# EAGLE design 04_ADD (EAGLE 7.5.0)
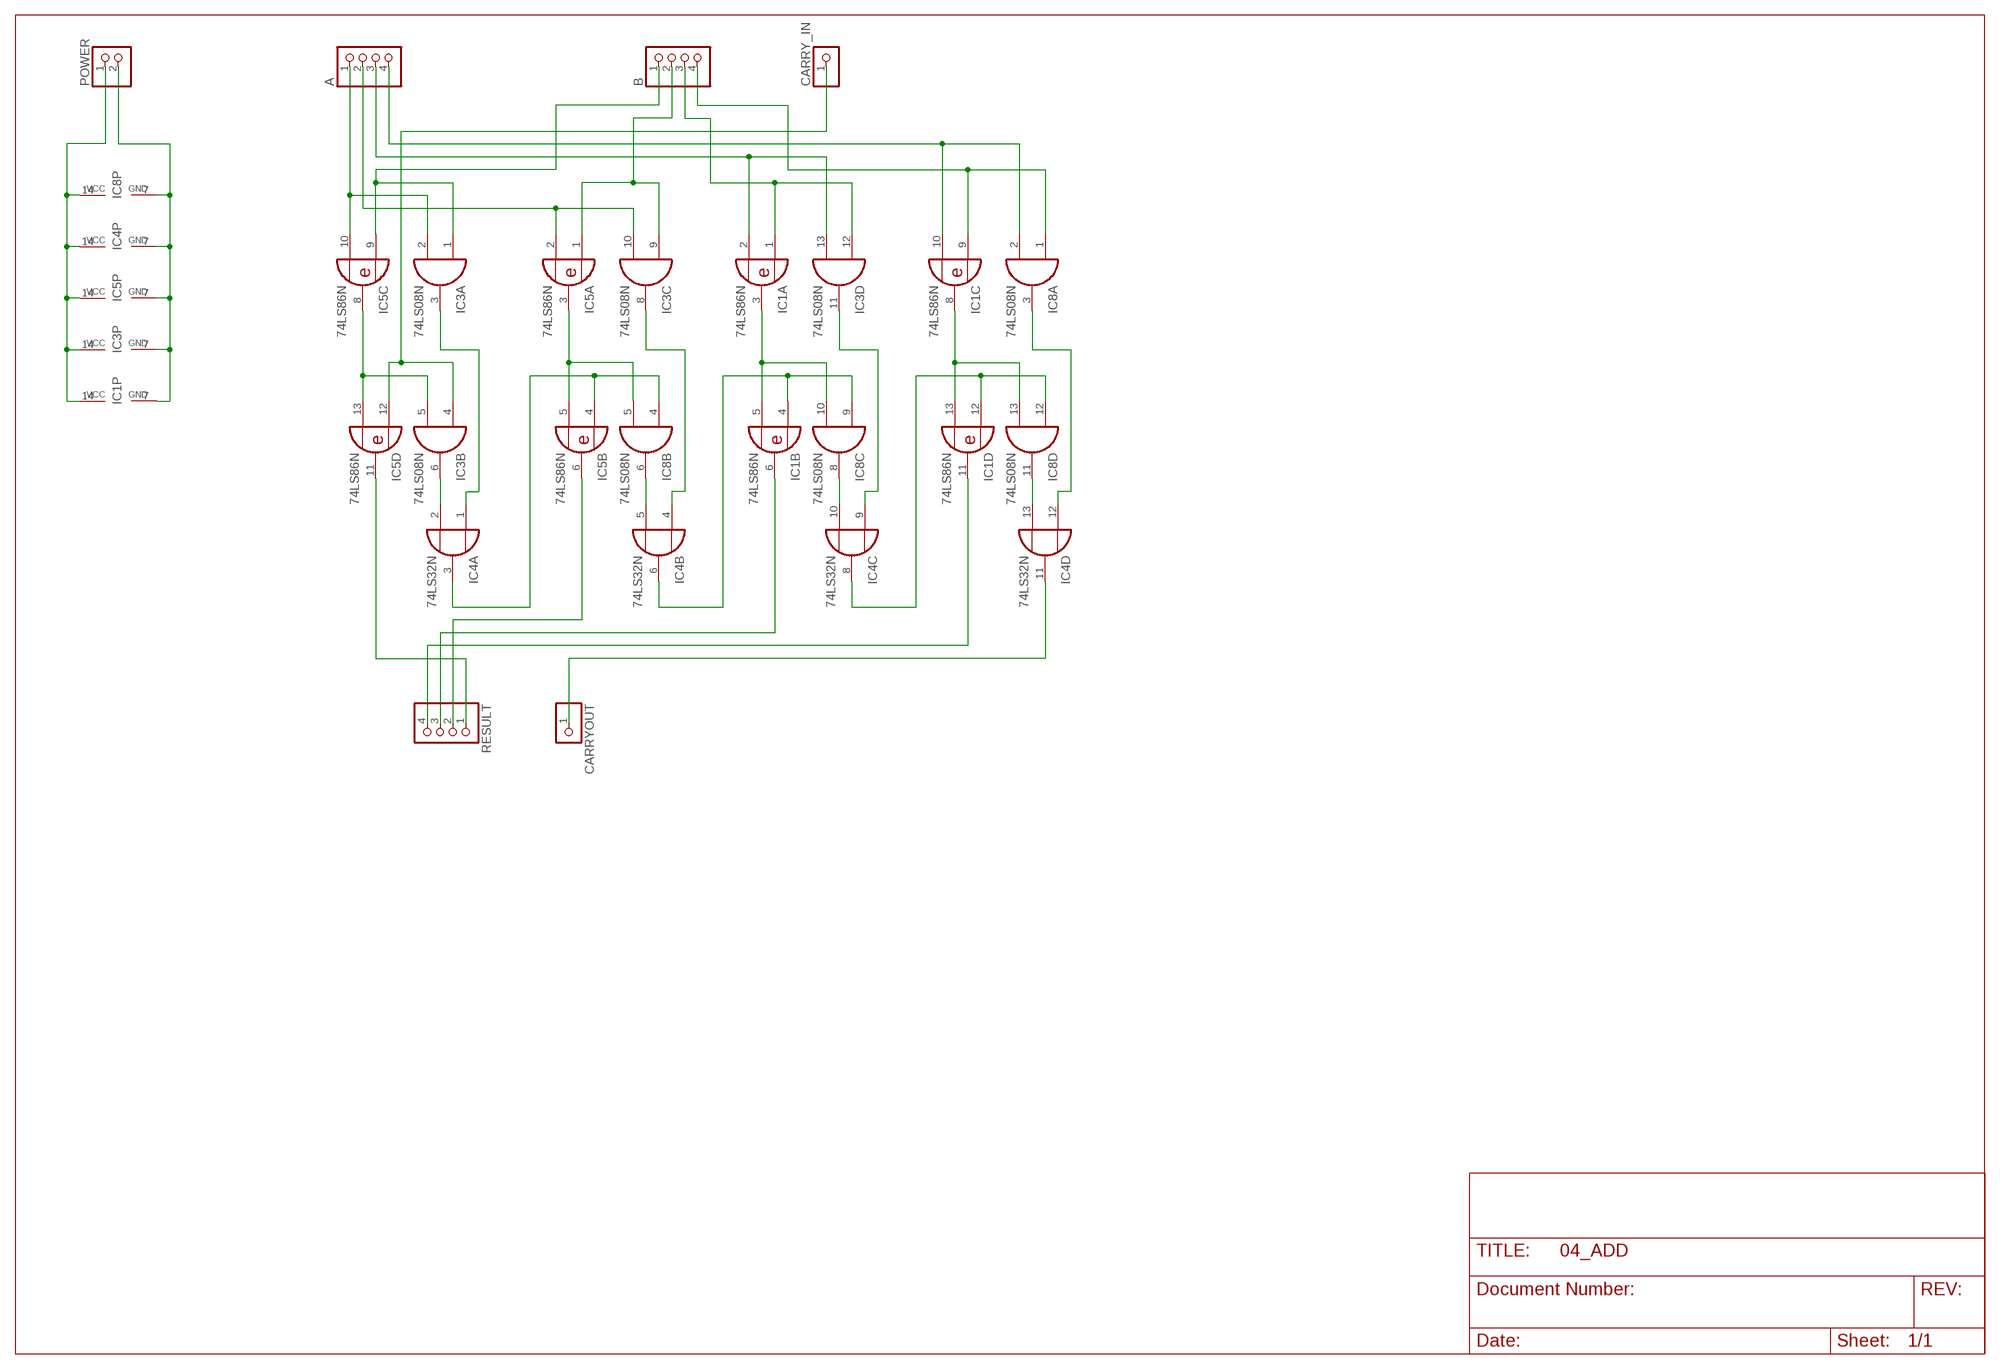
[diagram p0: schematic, sheet 1]

## Parts
A  PINHD-1X4  [1X04]
B  PINHD-1X4  [1X04]
CARRY_IN  PINHD-1X1  [1X01]
CARRYOUT  PINHD-1X1  [1X01]
IC1  74LS86N  [DIL14]
IC3  74LS08N  [DIL14]
IC4  74LS32N  [DIL14]
IC5  74LS86N  [DIL14]
IC8  74LS08N  [DIL14]
POWER  PINHD-1X2  [1X02]
RESULT  PINHD-1X4  [1X04]

## Nets
CARRY_OUT: CARRYOUT.1 IC4.11(D:O)
GND: IC1.7(P:GND) IC3.7(P:GND) IC4.7(P:GND) IC5.7(P:GND) IC8.7(P:GND) POWER.2
N$1: B.1 IC3.1(A:I0) IC5.9(C:I0)
N$3: B.3 IC1.1(A:I0) IC3.12(D:I0)
N$5: CARRY_IN.1 IC3.4(B:I0) IC5.12(D:I0)
N$6: A.1 IC3.2(A:I1) IC5.10(C:I1)
N$8: IC3.5(B:I1) IC5.8(C:O) IC5.13(D:I1)
N$9: IC5.11(D:O) RESULT.1
N$10: IC3.3(A:O) IC4.1(A:I0)
N$11: IC3.6(B:O) IC4.2(A:I1)
N$12: A.2 IC3.10(C:I1) IC5.2(A:I1)
N$13: A.3 IC1.2(A:I1) IC3.13(D:I1)
N$14: A.4 IC1.10(C:I1) IC8.2(A:I1)
N$15: B.2 IC3.9(C:I0) IC5.1(A:I0)
N$17: B.4 IC1.9(C:I0) IC8.1(A:I0)
N$18: IC5.3(A:O) IC5.5(B:I1) IC8.5(B:I1)
N$19: IC1.6(B:O) RESULT.3
N$20: IC1.3(A:O) IC1.5(B:I1) IC8.10(C:I1)
N$21: IC1.8(C:O) IC1.13(D:I1) IC8.13(D:I1)
N$22: IC4.3(A:O) IC5.4(B:I0) IC8.4(B:I0)
N$23: IC5.6(B:O) RESULT.2
N$24: IC1.11(D:O) RESULT.4
N$25: IC4.5(B:I1) IC8.6(B:O)
N$26: IC4.10(C:I1) IC8.8(C:O)
N$27: IC4.13(D:I1) IC8.11(D:O)
N$28: IC3.8(C:O) IC4.4(B:I0)
N$29: IC3.11(D:O) IC4.9(C:I0)
N$30: IC4.12(D:I0) IC8.3(A:O)
N$31: IC1.4(B:I0) IC4.6(B:O) IC8.9(C:I0)
N$32: IC1.12(D:I0) IC4.8(C:O) IC8.12(D:I0)
VCC: IC1.14(P:VCC) IC3.14(P:VCC) IC4.14(P:VCC) IC5.14(P:VCC) IC8.14(P:VCC) POWER.1

## Library data of the parts
A B RESULT = pinhead:PINHD-1X4: PIN HEADER
CARRY_IN CARRYOUT = pinhead:PINHD-1X1: PIN HEADER
IC1 IC5 = 74xx-eu:74*86: Quad 2-input EXCLUSIVE-OR (XOR) gate
IC3 IC8 = 74xx-eu:74*08: Quad 2-input AND gate
IC4 = 74xx-eu:74*32: Quad 2-input OR gate
POWER = pinhead:PINHD-1X2: PIN HEADER

## Board
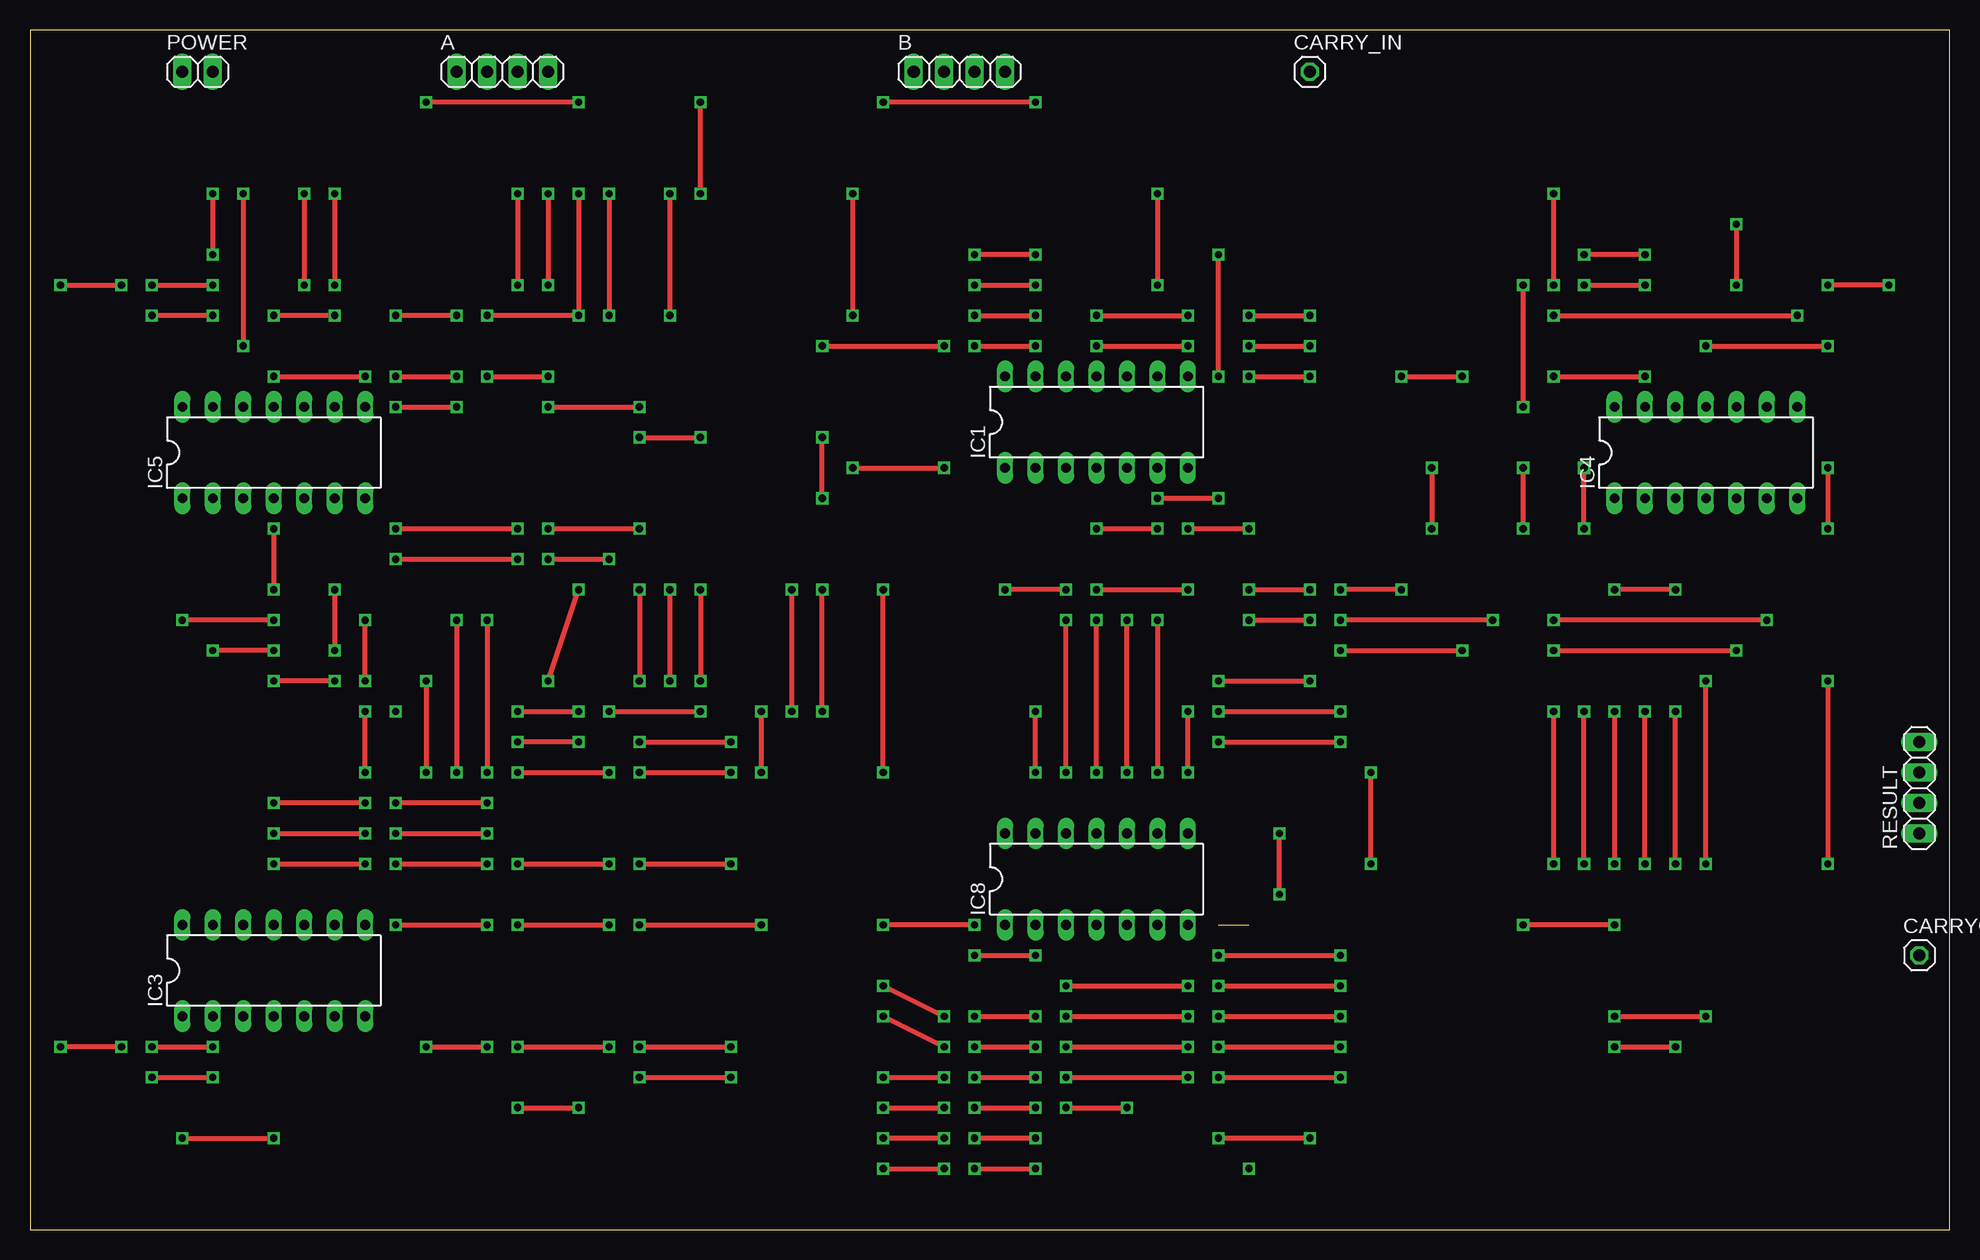
[diagram p1: board, top side]
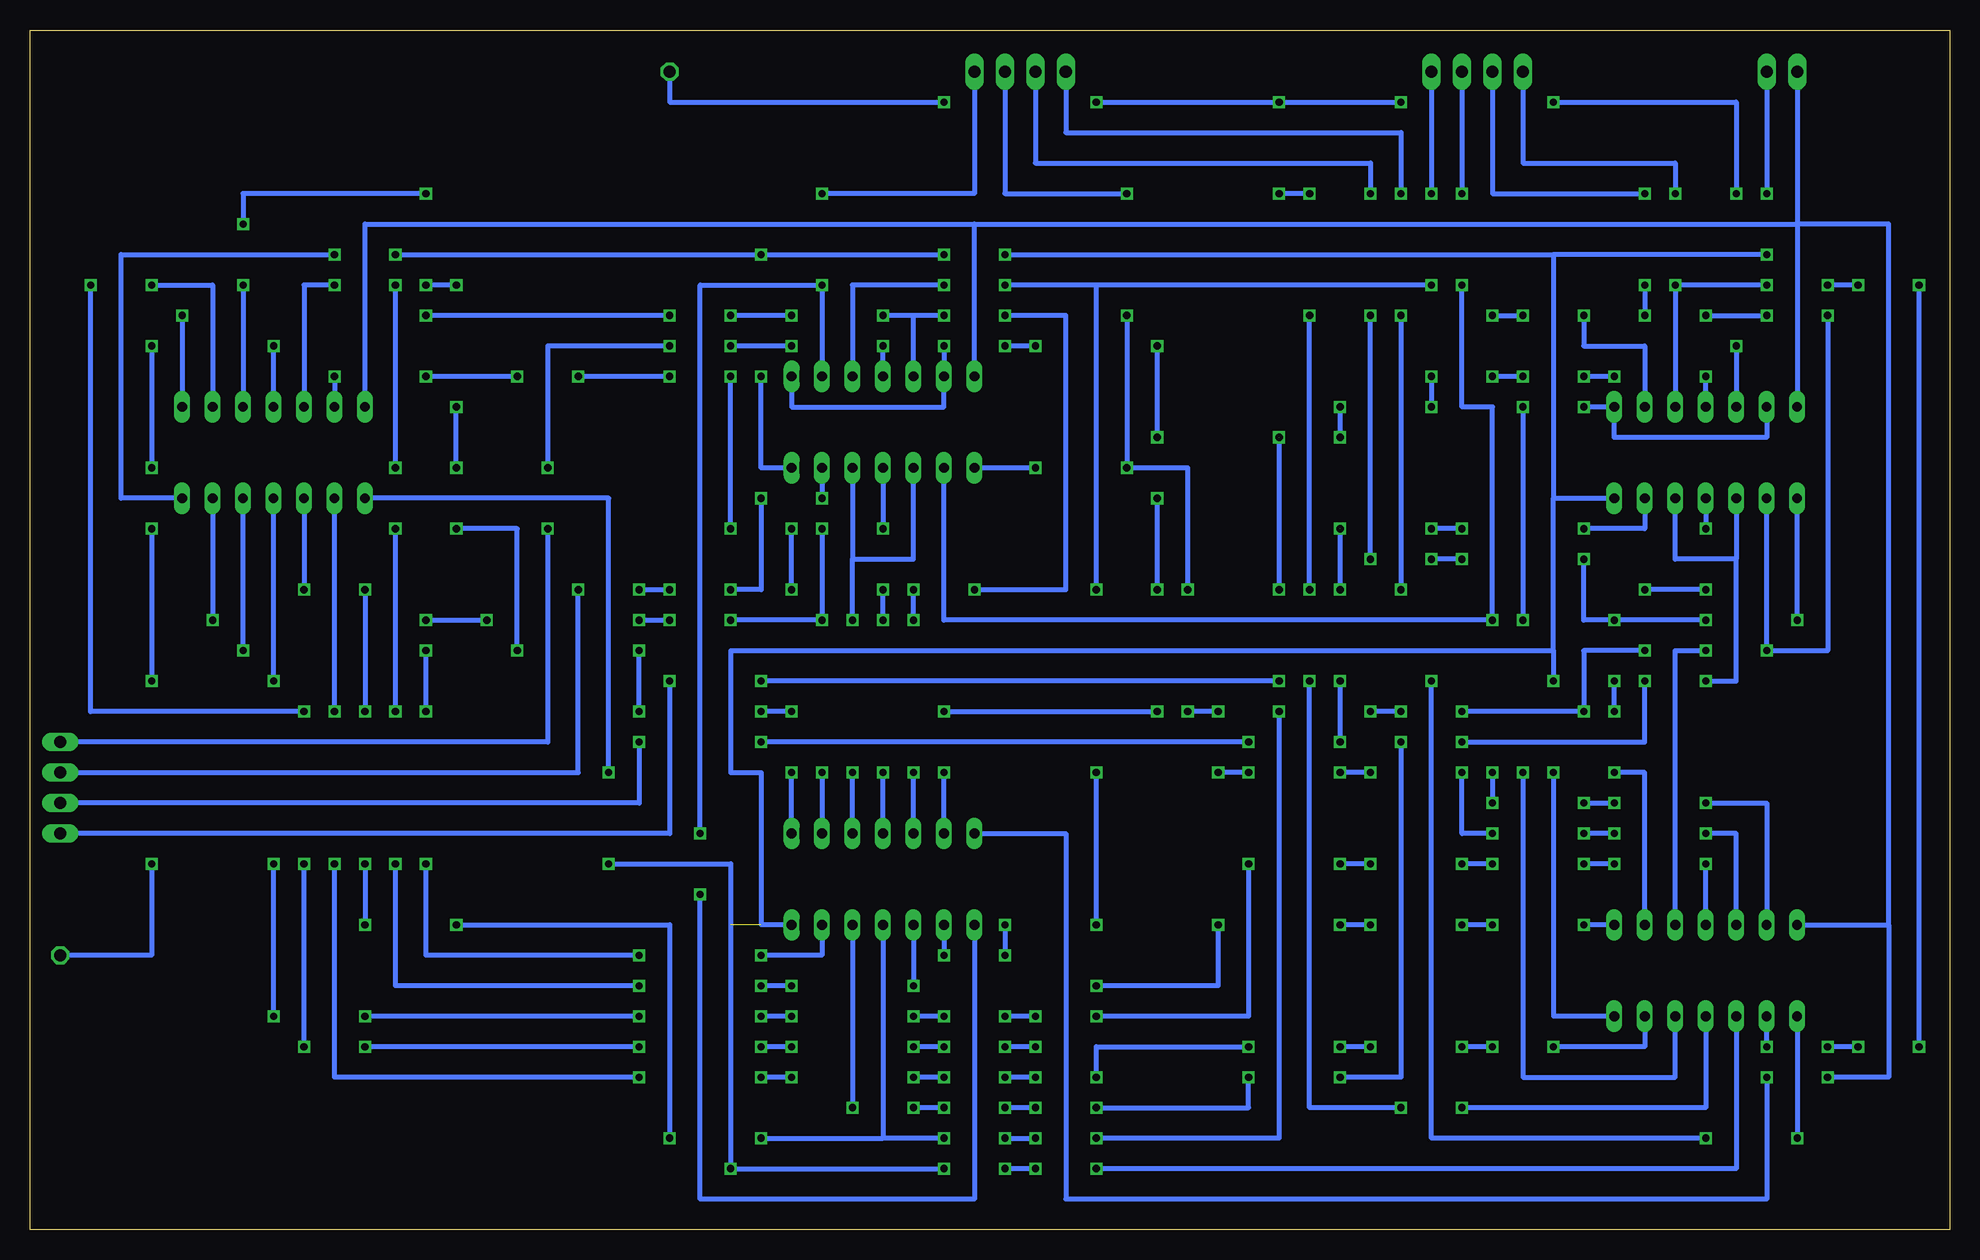
[diagram p2: board, bottom side, seen from below]

Size 160 x 100 mm. Coordinates in mm from the lower left corner, seen from the top.
Outline: 0,0 160,0 160,100 0,100 0,0
Copper layers (1*16): Top 0.035mm / dielectric 1.5mm / Bottom 0.035mm
Design rules "default": minimum track width 10mil, minimum drill 24mil, track to track 8mil, track to pad 8mil, pad to pad 8mil, via to via 8mil, smd to smd 8mil, copper to edge 40mil, drill to drill 8mil, minimum pad ring 10mil, minimum via ring 8mil, stop-mask expansion 4mil, vias tented up to drill 0mil, thermal gap 10mil

### Footprints (pad centres in the part's own frame; a part is rotated, then mirrored left to right if it is on the bottom)
1X04 = drill 1.016 long: 1 -3.81,0; 2 -1.27,0; 3 1.27,0; 4 3.81,0
1X01 = drill 1.016 octagon: 1 0,0
DIL14 = drill 0.813 long: 1 -7.62,-3.81; 2 -5.08,-3.81; 3 -2.54,-3.81; 4 0,-3.81; 5 2.54,-3.81; 6 5.08,-3.81; 7 7.62,-3.81; 8 7.62,3.81; 9 5.08,3.81; 10 2.54,3.81; 11 0,3.81; 12 -2.54,3.81; 13 -5.08,3.81; 14 -7.62,3.81
1X02 = drill 1.016 long: 1 -1.27,0; 2 1.27,0

### Placement (x,y rotation side)
A  39.37,96.52 0 top
B  77.47,96.52 0 top
CARRY_IN  106.68,96.52 0 top
CARRYOUT  157.48,22.86 0 top
IC1  88.9,67.31 0 top
IC3  20.32,21.59 0 top
IC4  139.7,64.77 0 top
IC5  20.32,64.77 0 top
IC8  88.9,29.21 0 top
POWER  13.97,96.52 0 top
RESULT  157.48,36.83 90 top

### Tracks (layer width: path | path; a pad name or v marks a point on that pad's centre or on a via)
CARRY_OUT  (via drill 0.6)
  Top 0.406: v139.7,73.66 v149.86,73.66 | v149.86,63.5 v149.86,58.42 | v149.86,45.72 v149.86,30.48
  Bottom 0.406: IC4.11 v139.7,73.66 | v149.86,73.66 v149.86,63.5 | v149.86,58.42 v149.86,45.72 | v149.86,30.48 149.86,22.86 CARRYOUT.1
GND  (via drill 0.6)  (1 unrouted)
  Top 0.406: v15.24,86.36 v15.24,81.28 | v134.62,81.28 v129.54,81.28 | v83.82,81.28 v78.74,81.28 | v33.02,45.72 v33.02,38.1 | v99.06,71.12 v99.06,81.28
  Bottom 0.406: POWER.2 v15.24,86.36 | v15.24,81.28 33.02,81.28 | 33.02,81.28 33.02,60.96 | 33.02,60.96 IC5.7 | 33.02,48.26 101.6,48.26 101.6,38.1 99.06,38.1 99.06,25.4 IC8.7 | 33.02,48.26 33.02,60.96 | IC3.7 33.02,17.78 v33.02,38.1 | IC4.7 152.4,60.96 152.4,81.28 v134.62,81.28 | v129.54,81.28 v99.06,81.28 v83.82,81.28 | v78.74,81.28 33.02,81.28 | 33.02,48.26 v33.02,45.72 | IC1.7 99.06,63.5 v99.06,71.12
N$1  (via drill 0.6)
  Top 0.406: v45.72,86.36 v45.72,76.2 v38.1,76.2 | v35.56,76.2 v30.48,76.2 | v12.7,7.62 v20.32,7.62 | v43.18,45.72 v45.72,53.34
  Bottom 0.406: B.1 73.66,91.44 45.72,91.44 v45.72,86.36 | v38.1,76.2 v35.56,76.2 | v30.48,76.2 30.48,73.66 25.4,73.66 IC5.9 | IC3.1 v12.7,7.62 | v20.32,7.62 43.18,7.62 v43.18,45.72 | v45.72,76.2 v45.72,53.34
N$3  (via drill 0.6)
  Top 0.406: v68.58,86.36 v68.58,76.2 | v68.58,63.5 v76.2,63.5 | v20.32,33.02 v27.94,33.02 | v30.48,33.02 v38.1,33.02 | v40.64,38.1 v48.26,38.1 | v50.8,38.1 v58.42,38.1 | v60.96,38.1 v60.96,43.18 | v63.5,43.18 v63.5,53.34
  Bottom 0.406: B.3 78.74,86.36 v68.58,86.36 | v68.58,76.2 v68.58,63.5 63.5,63.5 v63.5,53.34 | v76.2,63.5 IC1.1 | IC3.12 17.78,33.02 v20.32,33.02 | v27.94,33.02 v30.48,33.02 | v38.1,33.02 40.64,33.02 v40.64,38.1 | v48.26,38.1 v50.8,38.1 | v58.42,38.1 v60.96,38.1 | v60.96,43.18 v63.5,43.18
N$5  (via drill 0.6)
  Top 0.406: v83.82,93.98 v71.12,93.98 | v45.72,93.98 v33.02,93.98 | v17.78,86.36 v17.78,73.66 | v53.34,45.72 v53.34,53.34 | v40.64,10.16 v45.72,10.16 | v53.34,76.2 v53.34,86.36 | v55.88,86.36 v55.88,93.98
  Bottom 0.406: CARRY_IN.1 106.68,93.98 v83.82,93.98 | v71.12,93.98 v55.88,93.98 v45.72,93.98 | v33.02,93.98 17.78,93.98 v17.78,86.36 | v17.78,73.66 IC5.12 | IC3.4 20.32,10.16 v40.64,10.16 | v45.72,10.16 53.34,10.16 v53.34,45.72 | v53.34,53.34 v53.34,76.2 | v53.34,86.36 v55.88,86.36
N$6  (via drill 0.6)
  Top 0.406: v22.86,86.36 v22.86,78.74 | v7.62,15.24 v2.54,15.24 | v2.54,78.74 v7.62,78.74 | v10.16,78.74 v15.24,78.74 | v10.16,15.24 v15.24,15.24
  Bottom 0.406: A.1 35.56,88.9 22.86,88.9 v22.86,86.36 | IC5.10 v22.86,78.74 v15.24,78.74 | v2.54,15.24 v2.54,78.74 | v7.62,78.74 v10.16,78.74 | v7.62,15.24 v10.16,15.24 | v15.24,15.24 IC3.2
N$8  (via drill 0.6)
  Top 0.406: v30.48,68.58 v35.56,68.58 | v35.56,50.8 v35.56,38.1
  Bottom 0.406: IC5.13 15.24,66.04 27.94,66.04 IC5.8 v30.48,68.58 | v35.56,68.58 v35.56,50.8 | IC3.5 22.86,12.7 35.56,12.7 v35.56,38.1
N$9  (via drill 0.6)  (1 unrouted)
  Top 0.406: v20.32,71.12 v27.94,71.12 | v30.48,71.12 v35.56,71.12 | v55.88,53.34 v55.88,45.72 | v99.06,45.72 v106.68,45.72 | v38.1,71.12 v43.18,71.12 | v43.18,68.58 v50.8,68.58 | v50.8,66.04 v55.88,66.04
  Bottom 0.406: IC5.11 v20.32,71.12 | v27.94,71.12 v30.48,71.12 | v35.56,71.12 v38.1,71.12 | v55.88,66.04 v55.88,53.34 | v55.88,45.72 v99.06,45.72 | v106.68,45.72 106.68,33.02 RESULT.1 | v43.18,71.12 v43.18,68.58 | v50.8,68.58 v50.8,66.04
N$10  (via drill 0.6)
  Top 0.406: v71.12,5.08 v76.2,5.08 | v111.76,30.48 v111.76,38.1 | v78.74,5.08 v83.82,5.08
  Bottom 0.406: v111.76,38.1 111.76,60.96 IC4.1 | v76.2,5.08 v78.74,5.08 | IC3.3 17.78,5.08 v71.12,5.08 | v83.82,5.08 v101.6,5.08 101.6,30.48 v111.76,30.48
N$11  (via drill 0.6)
  Top 0.406: v33.02,15.24 v38.1,15.24 | v40.64,15.24 v48.26,15.24 | v50.8,15.24 v58.42,15.24 | v71.12,12.7 v76.2,12.7 | v78.74,12.7 v83.82,12.7 | v86.36,12.7 v96.52,12.7 | v99.06,12.7 v109.22,12.7 | v134.62,30.48 v134.62,43.18
  Bottom 0.406: IC3.6 25.4,15.24 v33.02,15.24 | v38.1,15.24 v40.64,15.24 | v48.26,15.24 v50.8,15.24 | v76.2,12.7 v78.74,12.7 | v83.82,12.7 v86.36,12.7 | v96.52,12.7 v99.06,12.7 | v109.22,12.7 134.62,12.7 v134.62,30.48 | v134.62,43.18 IC4.2 | v71.12,12.7 71.12,15.24 v58.42,15.24
N$12  (via drill 0.6)
  Top 0.406: v25.4,86.36 v25.4,78.74 | v25.4,76.2 v20.32,76.2 | v15.24,76.2 v10.16,76.2 | v20.32,48.26 v15.24,48.26
  Bottom 0.406: A.2 38.1,86.36 v25.4,86.36 | v25.4,78.74 v25.4,76.2 | v20.32,76.2 v15.24,76.2 | v10.16,76.2 10.16,48.26 v15.24,48.26 IC5.2 | IC3.10 22.86,48.26 v20.32,48.26
N$13  (via drill 0.6)
  Top 0.406: v40.64,86.36 v40.64,78.74 | v38.1,50.8 v38.1,38.1 | v38.1,35.56 v30.48,35.56 | v27.94,35.56 v20.32,35.56
  Bottom 0.406: A.3 v40.64,86.36 | IC1.2 83.82,50.8 v38.1,50.8 38.1,68.58 40.64,68.58 v40.64,78.74 | v38.1,38.1 v38.1,35.56 | v30.48,35.56 v27.94,35.56 | v20.32,35.56 15.24,35.56 IC3.13
N$14  (via drill 0.6)
  Top 0.406: v43.18,86.36 v43.18,78.74 | v78.74,78.74 v83.82,78.74 | v71.12,38.1 v71.12,53.34 | v78.74,25.4 v71.12,25.4 | v78.74,22.86 v83.82,22.86
  Bottom 0.406: A.4 v43.18,86.36 | v43.18,78.74 71.12,78.74 | 71.12,78.74 v78.74,78.74 | v83.82,78.74 91.44,78.74 IC1.10 | IC8.2 v83.82,22.86 | v71.12,25.4 v71.12,38.1 | v71.12,53.34 71.12,78.74 | v78.74,25.4 v78.74,22.86
N$15  (via drill 0.6)
  Top 0.406: v48.26,86.36 v48.26,76.2 | v20.32,50.8 v12.7,50.8 | v27.94,38.1 v27.94,43.18 | v27.94,45.72 v27.94,50.8 | v30.48,55.88 v40.64,55.88 | v43.18,55.88 v48.26,55.88
  Bottom 0.406: B.2 76.2,88.9 48.26,88.9 v48.26,86.36 | v12.7,50.8 IC5.1 | v20.32,50.8 v27.94,50.8 30.48,50.8 v30.48,55.88 | IC3.9 25.4,38.1 v27.94,38.1 | v27.94,43.18 v27.94,45.72 | v48.26,55.88 v48.26,76.2 | v40.64,55.88 v43.18,55.88
N$17  (via drill 0.6)
  Top 0.406: v93.98,86.36 v93.98,78.74 | v104.14,27.94 v104.14,33.02
  Bottom 0.406: B.4 81.28,86.36 v93.98,86.36 | IC1.9 v93.98,78.74 104.14,78.74 v104.14,33.02 | IC8.1 81.28,2.54 104.14,2.54 v104.14,27.94
  other vias: 81.28,25.4
N$18  (via drill 0.6)
  Top 0.406: v45.72,40.64 v40.64,40.64 | v25.4,45.72 v20.32,45.72 | v50.8,12.7 v58.42,12.7 | v71.12,10.16 v76.2,10.16 | v78.74,10.16 v83.82,10.16 | v86.36,10.16 v91.44,10.16
  Bottom 0.406: IC5.3 17.78,55.88 | 17.78,55.88 22.86,55.88 IC5.5 | IC8.5 v91.44,10.16 | v20.32,45.72 17.78,45.72 17.78,55.88 | v40.64,40.64 25.4,40.64 v25.4,45.72 | v45.72,40.64 45.72,12.7 v50.8,12.7 | v76.2,10.16 v78.74,10.16 | v83.82,10.16 v86.36,10.16 | v71.12,10.16 58.42,10.16 v58.42,12.7
N$19  (via drill 0.6)
  Top 0.406: v114.3,53.34 v109.22,53.34 | v93.98,60.96 v99.06,60.96 | v101.6,53.34 v106.68,53.34
  Bottom 0.406: RESULT.3 114.3,38.1 v114.3,53.34 | v109.22,53.34 v106.68,53.34 | IC1.6 v93.98,60.96 | v99.06,60.96 99.06,53.34 v101.6,53.34
  other vias: 93.98,63.5
N$20  (via drill 0.6)
  Top 0.406: v91.44,38.1 v91.44,50.8
  Bottom 0.406: IC1.5 91.44,55.88 | 91.44,55.88 86.36,55.88 IC1.3 | IC8.10 v91.44,38.1 | v91.44,50.8 91.44,55.88
N$21  (via drill 0.6)
  Top 0.406: v83.82,38.1 v83.82,43.18 | v66.04,43.18 v66.04,53.34 | v66.04,60.96 v66.04,66.04 | v66.04,73.66 v76.2,73.66 | v78.74,73.66 v83.82,73.66
  Bottom 0.406: IC8.13 v83.82,38.1 | v83.82,43.18 v66.04,43.18 | v66.04,53.34 v66.04,60.96 | v66.04,66.04 v66.04,73.66 | v83.82,73.66 IC1.13 83.82,68.58 96.52,68.58 IC1.8 | v76.2,73.66 v78.74,73.66
N$22  (via drill 0.6)
  Top 0.406: v20.32,58.42 v20.32,53.34 | v25.4,53.34 v25.4,48.26 | v40.64,43.18 v45.72,43.18 | v48.26,43.18 v55.88,43.18 | v83.82,7.62 v78.74,7.62 | v76.2,7.62 v71.12,7.62 | v137.16,53.34 v132.08,53.34 | v132.08,43.18 v132.08,30.48 | v132.08,25.4 v124.46,25.4 | v106.68,7.62 v99.06,7.62
  Bottom 0.406: IC5.4 v20.32,58.42 | v20.32,53.34 v25.4,53.34 | v25.4,48.26 30.48,48.26 v30.48,43.18 v40.64,43.18 | v45.72,43.18 v48.26,43.18 | v55.88,43.18 55.88,7.62 v71.12,7.62 | v78.74,7.62 v76.2,7.62 | IC4.3 v137.16,53.34 | v132.08,53.34 v132.08,43.18 | v132.08,30.48 v132.08,25.4 | v124.46,25.4 106.68,25.4 v106.68,7.62 | IC8.4 88.9,7.62 | v83.82,7.62 88.9,7.62 | v99.06,7.62 88.9,7.62
N$23  (via drill 0.6)  (1 unrouted)
  Top 0.406: v50.8,53.34 v50.8,45.72 | v50.8,40.64 v58.42,40.64 | v99.06,40.64 v109.22,40.64 | v30.48,58.42 v40.64,58.42 | v43.18,58.42 v50.8,58.42
  Bottom 0.406: IC5.6 25.4,58.42 v30.48,58.42 | v50.8,58.42 v50.8,53.34 | v50.8,45.72 v50.8,40.64 | v58.42,40.64 v99.06,40.64 | v109.22,40.64 109.22,35.56 RESULT.2 | v40.64,58.42 v43.18,58.42
N$24  (via drill 0.6)
  Top 0.406: v88.9,73.66 v96.52,73.66 | v101.6,73.66 v106.68,73.66 | v116.84,63.5 v116.84,58.42
  Bottom 0.406: IC1.11 v88.9,73.66 | v96.52,73.66 v101.6,73.66 | v106.68,73.66 116.84,73.66 v116.84,63.5 | v116.84,58.42 116.84,40.64 RESULT.4
N$25  (via drill 0.6)
  Top 0.406: v99.06,22.86 v109.22,22.86 | v127,30.48 v127,43.18 | v127,48.26 v142.24,48.26
  Bottom 0.406: IC8.6 93.98,22.86 v99.06,22.86 | v109.22,22.86 127,22.86 v127,30.48 | v127,43.18 v127,48.26 | v142.24,48.26 IC4.5
N$26  (via drill 0.6)
  Top 0.406: v96.52,38.1 v96.52,43.18 | v99.06,43.18 v109.22,43.18 | v109.22,48.26 v119.38,48.26 | v124.46,58.42 v124.46,63.5 | v124.46,68.58 v124.46,78.74 | v127,78.74 v127,86.36 | v142.24,83.82 v142.24,78.74
  Bottom 0.406: IC8.8 v96.52,38.1 | v96.52,43.18 v99.06,43.18 | v109.22,43.18 v109.22,48.26 | v124.46,63.5 v124.46,68.58 | v124.46,78.74 v127,78.74 | v127,86.36 142.24,86.36 v142.24,83.82 | v142.24,78.74 IC4.10 | v119.38,48.26 119.38,58.42 v124.46,58.42
N$27  (via drill 0.6)
  Top 0.406: v88.9,38.1 v88.9,50.8 | v88.9,53.34 v96.52,53.34 | v96.52,58.42 v101.6,58.42 | v101.6,71.12 v106.68,71.12 | v114.3,71.12 v119.38,71.12 | v127,71.12 v134.62,71.12
  Bottom 0.406: IC8.11 v88.9,38.1 | v88.9,50.8 v88.9,53.34 | v96.52,53.34 v96.52,58.42 | v101.6,58.42 v101.6,71.12 | v106.68,71.12 v114.3,71.12 | v119.38,71.12 v127,71.12 | v134.62,71.12 IC4.13
N$28  (via drill 0.6)
  Top 0.406: v30.48,25.4 v38.1,25.4 | v40.64,25.4 v48.26,25.4 | v50.8,25.4 v60.96,25.4 | v71.12,20.32 v76.2,17.78 | v78.74,17.78 v83.82,17.78 | v86.36,17.78 v96.52,17.78 | v99.06,17.78 v109.22,17.78 | v132.08,17.78 v139.7,17.78 | v139.7,30.48 v139.7,45.72
  Bottom 0.406: IC3.8 v30.48,25.4 | v38.1,25.4 v40.64,25.4 | v48.26,25.4 v50.8,25.4 | v60.96,25.4 60.96,20.32 v71.12,20.32 | v76.2,17.78 v78.74,17.78 | v83.82,17.78 v86.36,17.78 | v96.52,17.78 v99.06,17.78 | v109.22,17.78 v132.08,17.78 | v139.7,17.78 v139.7,30.48 | v139.7,45.72 IC4.4
N$29  (via drill 0.6)
  Top 0.406: v20.32,30.48 v27.94,30.48 | v30.48,30.48 v38.1,30.48 | v40.64,30.48 v48.26,30.48 | v50.8,30.48 v58.42,30.48 | v71.12,17.78 v76.2,15.24 | v78.74,15.24 v83.82,15.24 | v86.36,15.24 v96.52,15.24 | v99.06,15.24 v109.22,15.24 | v132.08,15.24 v137.16,15.24 | v137.16,30.48 v137.16,43.18 | v154.94,78.74 v149.86,78.74
  Bottom 0.406: IC3.11 v20.32,30.48 | v27.94,30.48 v30.48,30.48 | v38.1,30.48 v40.64,30.48 | v48.26,30.48 v50.8,30.48 | v58.42,30.48 58.42,17.78 v71.12,17.78 | v76.2,15.24 v78.74,15.24 | v83.82,15.24 v86.36,15.24 | v96.52,15.24 v99.06,15.24 | v109.22,15.24 v132.08,15.24 | v137.16,15.24 v137.16,30.48 | v137.16,43.18 154.94,43.18 v154.94,78.74 | v149.86,78.74 144.78,78.74 IC4.9
N$30  (via drill 0.6)
  Top 0.406: v86.36,20.32 v96.52,20.32 | v99.06,20.32 v109.22,20.32 | v129.54,30.48 v129.54,43.18 | v129.54,58.42 v129.54,63.5 | v129.54,78.74 v134.62,78.74
  Bottom 0.406: IC8.3 v86.36,20.32 | v96.52,20.32 v99.06,20.32 | v109.22,20.32 129.54,20.32 v129.54,30.48 | v129.54,63.5 v129.54,78.74 | v134.62,78.74 137.16,78.74 IC4.12 | v129.54,43.18 v129.54,58.42
N$31  (via drill 0.6)
  Top 0.406: v88.9,58.42 v93.98,58.42 | v93.98,50.8 v93.98,38.1 | v101.6,50.8 v106.68,50.8 | v121.92,50.8 v109.22,50.8 | v144.78,50.8 v127,50.8
  Bottom 0.406: IC1.4 v88.9,58.42 | v93.98,58.42 v93.98,50.8 v101.6,50.8 | v93.98,38.1 IC8.9 | IC4.6 v144.78,50.8 | v127,50.8 v121.92,50.8 | v109.22,50.8 v106.68,50.8
N$32  (via drill 0.6)
  Top 0.406: v88.9,76.2 v96.52,76.2 | v101.6,76.2 v106.68,76.2 | v127,76.2 v147.32,76.2 | v86.36,38.1 v86.36,50.8 | v86.36,53.34 v81.28,53.34 | v78.74,76.2 v83.82,76.2
  Bottom 0.406: IC1.12 86.36,76.2 | 86.36,76.2 v88.9,76.2 | v96.52,76.2 v101.6,76.2 | v106.68,76.2 v127,76.2 | v147.32,76.2 IC4.8 | IC8.12 v86.36,38.1 | v86.36,50.8 v86.36,53.34 | v81.28,53.34 73.66,53.34 73.66,76.2 v78.74,76.2 | v83.82,76.2 86.36,76.2
VCC  (via drill 0.6)
  Top 0.406: v10.16,12.7 v15.24,12.7
  Bottom 0.406: POWER.1 12.7,83.82 | 12.7,83.82 IC5.14 | IC3.14 5.08,25.4 | 5.08,25.4 5.08,83.82 12.7,83.82 | IC1.14 81.28,83.82 | 81.28,83.82 12.7,83.82 | IC8.14 73.66,33.02 73.66,2.54 15.24,2.54 v15.24,12.7 | IC4.14 132.08,83.82 81.28,83.82 | 5.08,25.4 5.08,12.7 v10.16,12.7